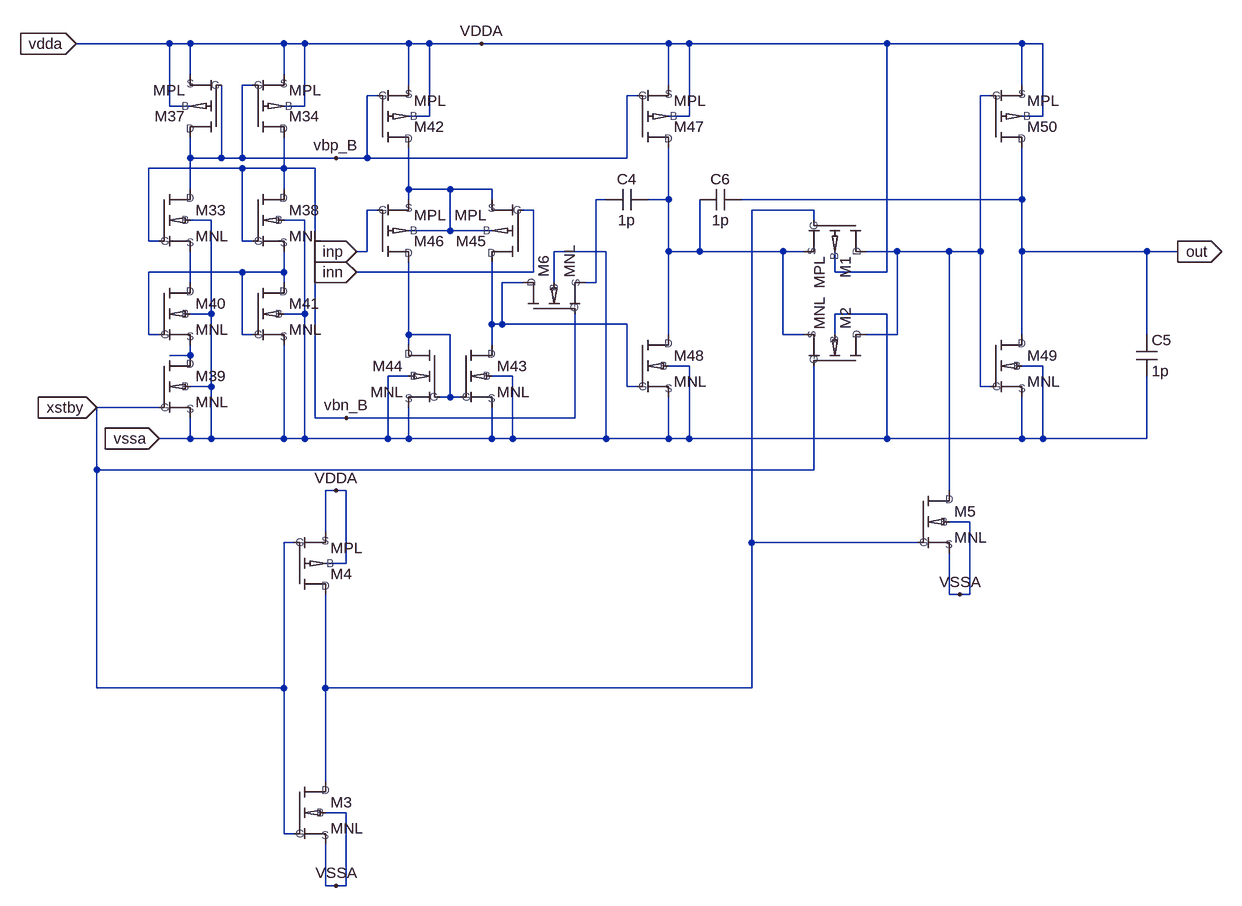
[diagram p0: schematic COMP_PLF_orig.asc]
COMP_PLF_orig.asc, the LTspice schematic file:
Version 4
SHEET 1 2052 2264
WIRE 368 208 224 208
WIRE 400 208 368 208
WIRE 544 208 400 208
WIRE 576 208 544 208
WIRE 736 208 576 208
WIRE 768 208 736 208
WIRE 848 208 768 208
WIRE 1136 208 848 208
WIRE 1168 208 1136 208
WIRE 1472 208 1168 208
WIRE 1680 208 1472 208
WIRE 1712 208 1680 208
WIRE 400 256 400 208
WIRE 544 256 544 208
WIRE 496 272 480 272
WIRE 736 272 736 208
WIRE 1136 272 1136 208
WIRE 1680 272 1680 208
WIRE 688 288 672 288
WIRE 1088 288 1072 288
WIRE 1632 288 1616 288
WIRE 368 304 368 208
WIRE 400 304 368 304
WIRE 576 304 576 208
WIRE 576 304 544 304
WIRE 768 320 768 208
WIRE 768 320 736 320
WIRE 1168 320 1168 208
WIRE 1168 320 1136 320
WIRE 1712 320 1712 208
WIRE 1712 320 1680 320
WIRE 400 384 400 352
WIRE 448 384 448 272
WIRE 448 384 400 384
WIRE 480 384 480 272
WIRE 480 384 448 384
WIRE 624 384 480 384
WIRE 672 384 672 288
WIRE 672 384 624 384
WIRE 1072 384 1072 288
WIRE 1072 384 672 384
WIRE 480 400 336 400
WIRE 544 400 544 352
WIRE 544 400 480 400
WIRE 592 400 544 400
WIRE 400 432 400 384
WIRE 544 432 544 400
WIRE 736 432 736 368
WIRE 800 432 736 432
WIRE 864 432 800 432
WIRE 736 448 736 432
WIRE 864 448 864 432
WIRE 1040 448 1024 448
WIRE 1136 448 1136 368
WIRE 1136 448 1104 448
WIRE 1680 448 1680 368
WIRE 1680 448 1248 448
WIRE 688 464 672 464
WIRE 928 464 912 464
WIRE 1360 464 1264 464
WIRE 432 480 400 480
WIRE 576 480 544 480
WIRE 1360 480 1360 464
WIRE 800 496 800 432
WIRE 800 496 736 496
WIRE 864 496 800 496
WIRE 336 512 336 400
WIRE 352 512 336 512
WIRE 480 512 480 400
WIRE 496 512 480 512
WIRE 672 528 672 464
WIRE 672 528 656 528
WIRE 1040 528 960 528
WIRE 1136 528 1136 448
WIRE 1184 528 1184 448
WIRE 1184 528 1136 528
WIRE 1312 528 1184 528
WIRE 1344 528 1312 528
WIRE 1488 528 1440 528
WIRE 1568 528 1488 528
WIRE 1616 528 1616 288
WIRE 1616 528 1568 528
WIRE 1680 528 1680 448
WIRE 1872 528 1680 528
WIRE 1920 528 1872 528
WIRE 480 560 336 560
WIRE 544 560 544 528
WIRE 544 560 480 560
WIRE 928 560 928 464
WIRE 928 560 656 560
WIRE 1392 560 1392 528
WIRE 1472 560 1472 208
WIRE 1472 560 1392 560
WIRE 400 576 400 528
WIRE 544 576 544 560
WIRE 912 576 880 576
WIRE 960 576 960 528
WIRE 1024 576 1024 448
WIRE 1024 576 1008 576
WIRE 432 624 432 480
WIRE 432 624 400 624
WIRE 576 624 576 480
WIRE 576 624 544 624
WIRE 1472 624 1392 624
WIRE 864 640 864 544
WIRE 880 640 880 576
WIRE 880 640 864 640
WIRE 1072 640 880 640
WIRE 336 656 336 560
WIRE 352 656 336 656
WIRE 480 656 480 560
WIRE 496 656 480 656
WIRE 736 656 736 544
WIRE 800 656 736 656
WIRE 1136 656 1136 528
WIRE 1312 656 1312 528
WIRE 1344 656 1312 656
WIRE 1392 656 1392 624
WIRE 1488 656 1488 528
WIRE 1488 656 1440 656
WIRE 1680 656 1680 528
WIRE 1872 656 1872 528
WIRE 736 672 736 656
WIRE 864 672 864 640
WIRE 400 688 400 672
WIRE 400 688 368 688
WIRE 1168 704 1136 704
WIRE 1712 704 1680 704
WIRE 736 720 704 720
WIRE 896 720 864 720
WIRE 432 736 432 624
WIRE 432 736 400 736
WIRE 1072 736 1072 640
WIRE 1088 736 1072 736
WIRE 1616 736 1616 528
WIRE 1632 736 1616 736
WIRE 800 752 800 656
WIRE 800 752 784 752
WIRE 816 752 800 752
WIRE 352 768 256 768
WIRE 592 784 592 400
WIRE 640 784 592 784
WIRE 992 784 992 624
WIRE 992 784 640 784
WIRE 400 816 400 784
WIRE 400 816 352 816
WIRE 432 816 432 736
WIRE 432 816 400 816
WIRE 544 816 544 672
WIRE 544 816 432 816
WIRE 576 816 576 624
WIRE 576 816 544 816
WIRE 704 816 704 720
WIRE 704 816 576 816
WIRE 736 816 736 768
WIRE 736 816 704 816
WIRE 864 816 864 768
WIRE 864 816 736 816
WIRE 896 816 896 720
WIRE 896 816 864 816
WIRE 1040 816 1040 528
WIRE 1040 816 896 816
WIRE 1136 816 1136 752
WIRE 1136 816 1040 816
WIRE 1168 816 1168 704
WIRE 1168 816 1136 816
WIRE 1472 816 1472 624
WIRE 1472 816 1168 816
WIRE 1680 816 1680 752
WIRE 1680 816 1472 816
WIRE 1712 816 1712 704
WIRE 1712 816 1680 816
WIRE 1872 816 1872 720
WIRE 1872 816 1712 816
WIRE 256 864 256 768
WIRE 1360 864 1360 704
WIRE 1360 864 256 864
WIRE 624 896 608 896
WIRE 640 896 624 896
WIRE 1568 896 1568 528
WIRE 1600 944 1568 944
WIRE 608 960 608 896
WIRE 560 976 544 976
WIRE 1264 976 1264 464
WIRE 1520 976 1264 976
WIRE 640 1008 640 896
WIRE 640 1008 608 1008
WIRE 1568 1056 1568 992
WIRE 1584 1056 1568 1056
WIRE 1600 1056 1600 944
WIRE 1600 1056 1584 1056
WIRE 256 1200 256 864
WIRE 544 1200 544 976
WIRE 544 1200 256 1200
WIRE 608 1200 608 1056
WIRE 1264 1200 1264 976
WIRE 1264 1200 608 1200
WIRE 608 1344 608 1200
WIRE 640 1392 608 1392
WIRE 544 1424 544 1200
WIRE 560 1424 544 1424
WIRE 608 1504 608 1440
WIRE 624 1504 608 1504
WIRE 640 1504 640 1392
WIRE 640 1504 624 1504
FLAG 656 560 inn
IOPIN 656 560 In
FLAG 656 528 inp
IOPIN 656 528 In
FLAG 1920 528 out
IOPIN 1920 528 Out
FLAG 224 208 vdda
IOPIN 224 208 In
FLAG 352 816 vssa
IOPIN 352 816 In
FLAG 624 384 vbp_B
FLAG 640 784 vbn_B
FLAG 256 768 xstby
IOPIN 256 768 In
FLAG 848 208 VDDA
FLAG 624 896 VDDA
FLAG 624 1504 VSSA
FLAG 1584 1056 VSSA
SYMBOL MNL 384 480 R0
SYMATTR InstName M33
SYMATTR SpiceLine l=1.2u w=6.45u pd=w+l+l ps=pd ad=w*l as=ad m=1
SYMBOL MPL 528 304 M180
SYMATTR InstName M34
SYMATTR SpiceLine l=1.2u w=13.8u pd=w+l+l ps=pd ad=w*l as=ad m=1
SYMBOL MPL 416 304 R180
SYMATTR InstName M37
SYMATTR SpiceLine l=1.2u w=13.8u pd=w+l+l ps=pd ad=w*l as=ad m=1
SYMBOL MNL 528 480 R0
SYMATTR InstName M38
SYMATTR SpiceLine l=1.2u w=6.45u pd=w+l+l ps=pd ad=w*l as=ad m=1
SYMBOL MNL 384 736 R0
SYMATTR InstName M39
SYMATTR SpiceLine l=2.0u w=3.3u pd=w+l+l ps=pd ad=w*l as=ad m=1
SYMBOL MNL 384 624 R0
SYMATTR InstName M40
SYMATTR SpiceLine l=1.2u w=18.1u pd=w+l+l ps=pd ad=w*l as=ad m=1
SYMBOL MNL 528 624 R0
SYMATTR InstName M41
SYMATTR SpiceLine l=1.2u w=7.2u pd=w+l+l ps=pd ad=w*l as=ad m=1
SYMBOL MPL 720 320 M180
SYMATTR InstName M42
SYMATTR SpiceLine l=1.2u w=13.5u pd=w+l+l ps=pd ad=w*l as=ad m=1
SYMBOL MNL 848 720 R0
SYMATTR InstName M43
SYMATTR SpiceLine l=1.2u w=3.7u pd=w+l+l ps=pd ad=w*l as=ad m=1
SYMBOL MNL 752 720 M0
SYMATTR InstName M44
SYMATTR SpiceLine l=1.2u w=3.7u pd=w+l+l ps=pd ad=w*l as=ad m=1
SYMBOL MPL 880 496 R180
SYMATTR InstName M45
SYMATTR SpiceLine l=1.2u w=10.0u pd=w+l+l ps=pd ad=w*l as=ad m=1
SYMBOL MPL 720 496 M180
SYMATTR InstName M46
SYMATTR SpiceLine l=1.2u w=10.0u pd=w+l+l ps=pd ad=w*l as=ad m=1
SYMBOL MPL 1120 320 M180
SYMATTR InstName M47
SYMATTR SpiceLine l=1.2u w=20.0u pd=w+l+l ps=pd ad=w*l as=ad m=10
SYMBOL MNL 1120 704 R0
SYMATTR InstName M48
SYMATTR SpiceLine l=1.2u w=23.8u pd=w+l+l ps=pd ad=w*l as=ad m=4
SYMBOL MNL 1664 704 R0
SYMATTR InstName M49
SYMATTR SpiceLine l=1.2u w=12.33u pd=w+l+l ps=pd ad=w*l as=ad m=2
SYMBOL MPL 1664 320 M180
SYMATTR InstName M50
SYMATTR SpiceLine l=1.2u w=20.0u pd=w+l+l ps=pd ad=w*l as=ad m=4
SYMBOL cap 1104 432 R90
WINDOW 0 0 32 VBottom 2
WINDOW 3 32 32 VTop 2
SYMATTR InstName C4
SYMATTR Value 1p
SYMBOL cap 1856 656 R0
SYMATTR InstName C5
SYMATTR Value 1p
SYMBOL cap 1248 432 R90
WINDOW 0 0 32 VBottom 2
WINDOW 3 32 32 VTop 2
SYMATTR InstName C6
SYMATTR Value 1p
SYMBOL MPL 1392 512 R90
SYMATTR InstName M1
SYMATTR SpiceLine l=1.0u w=20.0u pd=w+l+l ps=pd ad=w*l as=ad m=1
SYMBOL MNL 1392 672 M270
SYMATTR InstName M2
SYMATTR SpiceLine l=1.0u w=12.u pd=w+l+l ps=pd ad=w*l as=ad m=1
SYMBOL MNL 592 1392 R0
SYMATTR InstName M3
SYMATTR SpiceLine l=1.0u w=12.u pd=w+l+l ps=pd ad=w*l as=ad m=1
SYMBOL MPL 592 1008 M180
SYMATTR InstName M4
SYMATTR SpiceLine l=1.0u w=20.0u pd=w+l+l ps=pd ad=w*l as=ad m=1
SYMBOL MNL 1552 944 R0
SYMATTR InstName M5
SYMATTR SpiceLine l=1.0u w=12.u pd=w+l+l ps=pd ad=w*l as=ad m=1
SYMBOL MNL 960 592 R270
SYMATTR InstName M6
SYMATTR SpiceLine l=1.2u w=14.4u pd=w+l+l ps=pd ad=w*l as=ad m=2

The netlist it stands for:
* COMP_PLF_orig.asc
XM33 vbp_B vbn_B N007 vssa MNL l=1.2u w=6.45u pd=w+l+l ps=pd ad=w*l as=ad m=1  ; pins D G S B
XM34 vbn_B vbp_B vdda vdda MPL l=1.2u w=13.8u pd=w+l+l ps=pd ad=w*l as=ad m=1  ; pins D G S B
XM37 vbp_B vbp_B vdda vdda MPL l=1.2u w=13.8u pd=w+l+l ps=pd ad=w*l as=ad m=1  ; pins D G S B
XM38 vbn_B vbn_B N006 vssa MNL l=1.2u w=6.45u pd=w+l+l ps=pd ad=w*l as=ad m=1  ; pins D G S B
XM39 N010 xstby vssa vssa MNL l=2.0u w=3.3u pd=w+l+l ps=pd ad=w*l as=ad m=1  ; pins D G S B
XM40 N007 N006 N010 vssa MNL l=1.2u w=18.1u pd=w+l+l ps=pd ad=w*l as=ad m=1  ; pins D G S B
XM41 N006 N006 vssa vssa MNL l=1.2u w=7.2u pd=w+l+l ps=pd ad=w*l as=ad m=1  ; pins D G S B
XM42 N002 vbp_B vdda vdda MPL l=1.2u w=13.5u pd=w+l+l ps=pd ad=w*l as=ad m=1  ; pins D G S B
XM43 N008 N009 vssa vssa MNL l=1.2u w=3.7u pd=w+l+l ps=pd ad=w*l as=ad m=1  ; pins D G S B
XM44 N009 N009 vssa vssa MNL l=1.2u w=3.7u pd=w+l+l ps=pd ad=w*l as=ad m=1  ; pins D G S B
XM45 N008 inn N002 N002 MPL l=1.2u w=10.0u pd=w+l+l ps=pd ad=w*l as=ad m=1  ; pins D G S B
XM46 N009 inp N002 N002 MPL l=1.2u w=10.0u pd=w+l+l ps=pd ad=w*l as=ad m=1  ; pins D G S B
XM47 N004 vbp_B vdda vdda MPL l=1.2u w=20.0u pd=w+l+l ps=pd ad=w*l as=ad m=10  ; pins D G S B
XM48 N004 N008 vssa vssa MNL l=1.2u w=23.8u pd=w+l+l ps=pd ad=w*l as=ad m=4  ; pins D G S B
XM49 out N001 vssa vssa MNL l=1.2u w=12.33u pd=w+l+l ps=pd ad=w*l as=ad m=2  ; pins D G S B
XM50 out N001 vdda vdda MPL l=1.2u w=20.0u pd=w+l+l ps=pd ad=w*l as=ad m=4  ; pins D G S B
C4 N004 N003 1p
C5 out vssa 1p
C6 out N004 1p
XM1 N001 N005 N004 vdda MPL l=1.0u w=20.0u pd=w+l+l ps=pd ad=w*l as=ad m=1  ; pins D G S B
XM2 N001 xstby N004 vssa MNL l=1.0u w=12.u pd=w+l+l ps=pd ad=w*l as=ad m=1  ; pins D G S B
XM3 N005 xstby vssa vssa MNL l=1.0u w=12.u pd=w+l+l ps=pd ad=w*l as=ad m=1  ; pins D G S B
XM4 N005 xstby vdda vdda MPL l=1.0u w=20.0u pd=w+l+l ps=pd ad=w*l as=ad m=1  ; pins D G S B
XM5 N001 N005 vssa vssa MNL l=1.0u w=12.u pd=w+l+l ps=pd ad=w*l as=ad m=1  ; pins D G S B
XM6 N008 vbn_B N003 vssa MNL l=1.2u w=14.4u pd=w+l+l ps=pd ad=w*l as=ad m=2  ; pins D G S B
.backanno
.end